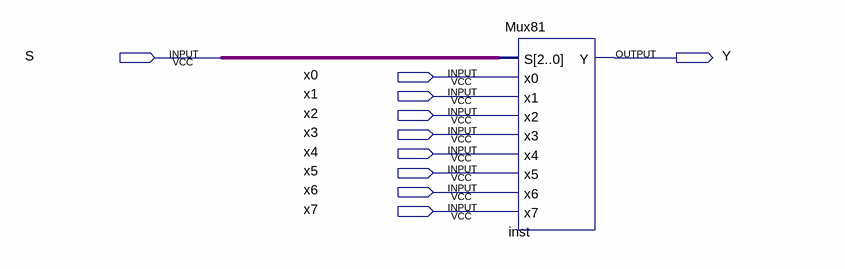
[diagram p0: schematic sheet]
// Quartus schematic Ex4.bdf as structural Verilog: 1 symbols, 10 pins
module Ex4 (
  input  S,
  input  x0,
  input  x1,
  input  x2,
  input  x3,
  input  x4,
  input  x5,
  input  x6,
  input  x7,
  output Y
);

  wire [2:0] undriven;

  Mux81 inst (.S(undriven), .x0(x0), .x1(x1), .x2(x2), .x3(x3), .x4(x4), .x5(x5), .x6(x6), .x7(x7), .Y(Y));
endmodule
